# Altium project ASV4-1 Actuation Driver Board.PrjPcb (part 3 of 3)
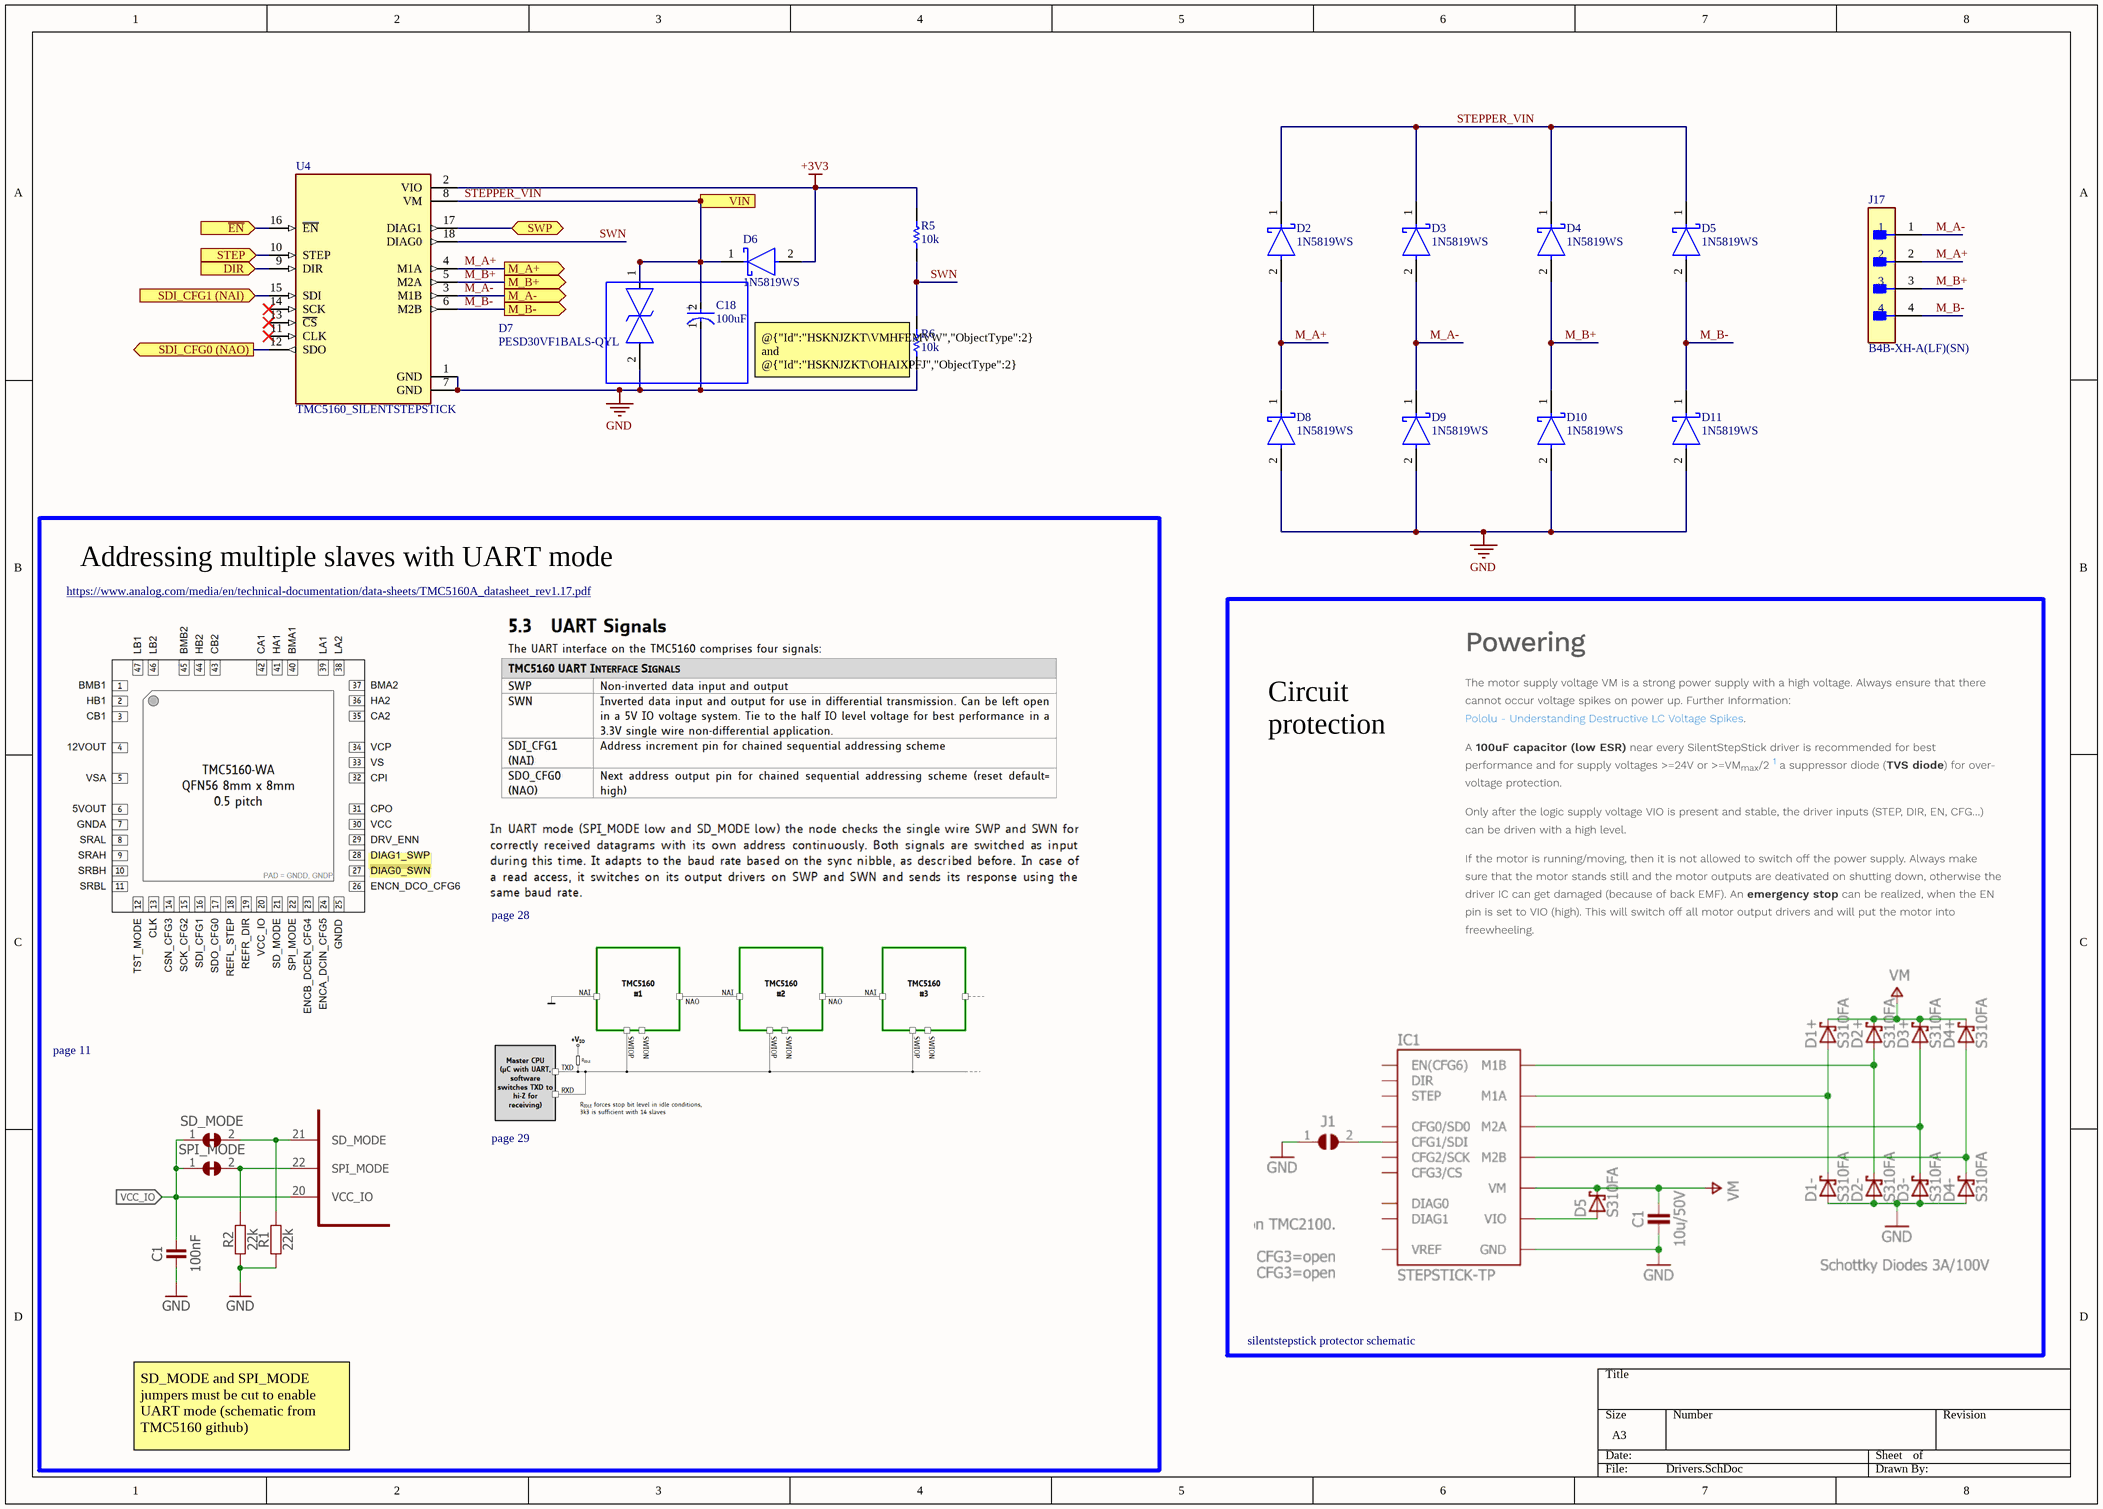
[diagram p10: Drivers.SchDoc]

## Nets that join several sheets
+3V3: Actuation (7 pins), U_Differential Encoder Receiver 1 (C25_U_Differential_Encoder_Receiver_1.1 U7_U_Differential_Encoder_Receiver_1.4 U7_U_Differential_Encoder_Receiver_1.16), U_Differential Encoder Receiver 2 (C25_U_Differential_Encoder_Receiver_2.1 U7_U_Differential_Encoder_Receiver_2.4 U7_U_Differential_Encoder_Receiver_2.16), U_Differential Encoder Receiver 3 (C25_U_Differential_Encoder_Receiver_3.1 U7_U_Differential_Encoder_Receiver_3.4 U7_U_Differential_Encoder_Receiver_3.16), Power (C20.2 D13.2 J21.2 U6.2), ISO_CAN (FB1.1 R16.1 R20.2 R21.2), STM32F407VET6 (21 pins), U_Drivers (D6_U_Drivers#1.2 R5_U_Drivers#1.2 U4_U_Drivers#1.2), U_Drivers (D6_U_Drivers#2.2 R5_U_Drivers#2.2 U4_U_Drivers#2.2), U_Drivers (D6_U_Drivers#3.2 R5_U_Drivers#3.2 U4_U_Drivers#3.2), U_Drivers (D6_U_Drivers#4.2 R5_U_Drivers#4.2 U4_U_Drivers#4.2), U_Drivers (D6_U_Drivers#5.2 R5_U_Drivers#5.2 U4_U_Drivers#5.2), U_Drivers (D6_U_Drivers#6.2 R5_U_Drivers#6.2 U4_U_Drivers#6.2), U_Drivers (D6_U_Drivers#7.2 R5_U_Drivers#7.2 U4_U_Drivers#7.2), U_Drivers (D6_U_Drivers#8.2 R5_U_Drivers#8.2 U4_U_Drivers#8.2), U_Drivers (D6_U_Drivers#9.2 R5_U_Drivers#9.2 U4_U_Drivers#9.2), U_Drivers (D6_U_Drivers#10.2 R5_U_Drivers#10.2 U4_U_Drivers#10.2), U_Drivers (D6_U_Drivers#11.2 R5_U_Drivers#11.2 U4_U_Drivers#11.2), U_Drivers (D6_U_Drivers#12.2 R5_U_Drivers#12.2 U4_U_Drivers#12.2), U_Drivers (D6_U_Drivers#13.2 R5_U_Drivers#13.2 U4_U_Drivers#13.2), U_Drivers (D6_U_Drivers#14.2 R5_U_Drivers#14.2 U4_U_Drivers#14.2), U_Differential Encoder Receiver 4 (C25_U_Differential_Encoder_Receiver_4.1 U7_U_Differential_Encoder_Receiver_4.4 U7_U_Differential_Encoder_Receiver_4.16)
+5V: Actuation (11 pins), Power (6 pins), ISO_CAN (FB2.1)
GND: Actuation (24 pins), U_Differential Encoder Receiver 1 (C25_U_Differential_Encoder_Receiver_1.2 U7_U_Differential_Encoder_Receiver_1.8 U7_U_Differential_Encoder_Receiver_1.12), U_Differential Encoder Receiver 2 (C25_U_Differential_Encoder_Receiver_2.2 U7_U_Differential_Encoder_Receiver_2.8 U7_U_Differential_Encoder_Receiver_2.12), U_Differential Encoder Receiver 3 (C25_U_Differential_Encoder_Receiver_3.2 U7_U_Differential_Encoder_Receiver_3.8 U7_U_Differential_Encoder_Receiver_3.12), Power (15 pins), ISO_CAN (6 pins), STM32F407VET6 (25 pins), U_Drivers (9 pins), U_Drivers (9 pins), U_Drivers (9 pins), U_Drivers (9 pins), U_Drivers (9 pins), U_Drivers (9 pins), U_Drivers (9 pins), U_Drivers (9 pins), U_Drivers (9 pins), U_Drivers (9 pins), U_Drivers (9 pins), U_Drivers (9 pins), U_Drivers (9 pins), U_Drivers (10 pins), U_Differential Encoder Receiver 4 (C25_U_Differential_Encoder_Receiver_4.2 U7_U_Differential_Encoder_Receiver_4.8 U7_U_Differential_Encoder_Receiver_4.12)
STEPPER_VIN: Actuation (F1.3 F1.4 J23.P), Power (C21.1 U5.7), U_Drivers (8 pins), U_Drivers (8 pins), U_Drivers (8 pins), U_Drivers (8 pins), U_Drivers (8 pins), U_Drivers (8 pins), U_Drivers (8 pins)
STEPPER_VIN: Actuation (F2.3 F2.4 J22.P), U_Drivers (8 pins), U_Drivers (8 pins), U_Drivers (8 pins), U_Drivers (8 pins), U_Drivers (8 pins), U_Drivers (8 pins), U_Drivers (8 pins)
1_N: Actuation (J3.5), U_Differential Encoder Receiver 1 (R11_U_Differential_Encoder_Receiver_1.1 U7_U_Differential_Encoder_Receiver_1.1)
1_N: Actuation (J6.5), U_Differential Encoder Receiver 2 (R11_U_Differential_Encoder_Receiver_2.1 U7_U_Differential_Encoder_Receiver_2.1)
1_N: Actuation (J9.5), U_Differential Encoder Receiver 3 (R11_U_Differential_Encoder_Receiver_3.1 U7_U_Differential_Encoder_Receiver_3.1)
1_N: Actuation (J12.5), U_Differential Encoder Receiver 4 (R11_U_Differential_Encoder_Receiver_4.1 U7_U_Differential_Encoder_Receiver_4.1)
1_P: Actuation (J3.1), U_Differential Encoder Receiver 1 (R11_U_Differential_Encoder_Receiver_1.2 U7_U_Differential_Encoder_Receiver_1.2)
1_P: Actuation (J6.1), U_Differential Encoder Receiver 2 (R11_U_Differential_Encoder_Receiver_2.2 U7_U_Differential_Encoder_Receiver_2.2)
1_P: Actuation (J9.1), U_Differential Encoder Receiver 3 (R11_U_Differential_Encoder_Receiver_3.2 U7_U_Differential_Encoder_Receiver_3.2)
1_P: Actuation (J12.1), U_Differential Encoder Receiver 4 (R11_U_Differential_Encoder_Receiver_4.2 U7_U_Differential_Encoder_Receiver_4.2)
2_N: Actuation (J3.6), U_Differential Encoder Receiver 1 (R12_U_Differential_Encoder_Receiver_1.1 U7_U_Differential_Encoder_Receiver_1.7)
2_N: Actuation (J6.6), U_Differential Encoder Receiver 2 (R12_U_Differential_Encoder_Receiver_2.1 U7_U_Differential_Encoder_Receiver_2.7)
2_N: Actuation (J9.6), U_Differential Encoder Receiver 3 (R12_U_Differential_Encoder_Receiver_3.1 U7_U_Differential_Encoder_Receiver_3.7)
2_N: Actuation (J12.6), U_Differential Encoder Receiver 4 (R12_U_Differential_Encoder_Receiver_4.1 U7_U_Differential_Encoder_Receiver_4.7)
2_P: Actuation (J3.2), U_Differential Encoder Receiver 1 (R12_U_Differential_Encoder_Receiver_1.2 U7_U_Differential_Encoder_Receiver_1.6)
2_P: Actuation (J6.2), U_Differential Encoder Receiver 2 (R12_U_Differential_Encoder_Receiver_2.2 U7_U_Differential_Encoder_Receiver_2.6)
2_P: Actuation (J9.2), U_Differential Encoder Receiver 3 (R12_U_Differential_Encoder_Receiver_3.2 U7_U_Differential_Encoder_Receiver_3.6)
2_P: Actuation (J12.2), U_Differential Encoder Receiver 4 (R12_U_Differential_Encoder_Receiver_4.2 U7_U_Differential_Encoder_Receiver_4.6)
3_N: Actuation (J3.7), U_Differential Encoder Receiver 1 (R13_U_Differential_Encoder_Receiver_1.1 U7_U_Differential_Encoder_Receiver_1.9)
3_N: Actuation (J6.7), U_Differential Encoder Receiver 2 (R13_U_Differential_Encoder_Receiver_2.1 U7_U_Differential_Encoder_Receiver_2.9)
3_N: Actuation (J9.7), U_Differential Encoder Receiver 3 (R13_U_Differential_Encoder_Receiver_3.1 U7_U_Differential_Encoder_Receiver_3.9)
3_N: Actuation (J12.7), U_Differential Encoder Receiver 4 (R13_U_Differential_Encoder_Receiver_4.1 U7_U_Differential_Encoder_Receiver_4.9)
3_P: Actuation (J3.3), U_Differential Encoder Receiver 1 (R13_U_Differential_Encoder_Receiver_1.2 U7_U_Differential_Encoder_Receiver_1.10)
3_P: Actuation (J6.3), U_Differential Encoder Receiver 2 (R13_U_Differential_Encoder_Receiver_2.2 U7_U_Differential_Encoder_Receiver_2.10)
3_P: Actuation (J9.3), U_Differential Encoder Receiver 3 (R13_U_Differential_Encoder_Receiver_3.2 U7_U_Differential_Encoder_Receiver_3.10)
3_P: Actuation (J12.3), U_Differential Encoder Receiver 4 (R13_U_Differential_Encoder_Receiver_4.2 U7_U_Differential_Encoder_Receiver_4.10)
BUZZER: Actuation (R17.2 R18.1), STM32F407VET6 (U1.35)
CAN1_RX: ISO_CAN (B1.5 LED3.1), STM32F407VET6 (U1.81)
CAN1_TX: ISO_CAN (B1.3 LED2.1), STM32F407VET6 (U1.82)
CAN_GND_ISO: Actuation (J1.3), ISO_CAN (8 pins)
CAN_N: Actuation (J1.4), ISO_CAN (B1.18 R15.1)
CAN_P: Actuation (J1.2), ISO_CAN (B1.19 JP1.1)
DIR_2: STM32F407VET6 (U1.80), U_Drivers (U4_U_Drivers#2.9)
DIR_3: STM32F407VET6 (U1.44), U_Drivers (U4_U_Drivers#6.9)
DIR_4: STM32F407VET6 (U1.46), U_Drivers (U4_U_Drivers#7.9)
DIR_5: STM32F407VET6 (U1.63), U_Drivers (U4_U_Drivers#3.9)
DIR_6: STM32F407VET6 (U1.57), U_Drivers (U4_U_Drivers#4.9)
DIR_7: STM32F407VET6 (U1.59), U_Drivers (U4_U_Drivers#5.9)
DIR_8: STM32F407VET6 (U1.39), U_Drivers (U4_U_Drivers#1.9)
DIR_9: STM32F407VET6 (U1.17), U_Drivers (U4_U_Drivers#12.9)
DIR_10: STM32F407VET6 (U1.30), U_Drivers (U4_U_Drivers#13.9)
DIR_11: STM32F407VET6 (U1.3), U_Drivers (U4_U_Drivers#14.9)
DIR_12: STM32F407VET6 (U1.8), U_Drivers (U4_U_Drivers#8.9)
DIR_13: STM32F407VET6 (U1.88), U_Drivers (U4_U_Drivers#9.9)
DIR_14: STM32F407VET6 (U1.97), U_Drivers (U4_U_Drivers#10.9)
DIR_15: STM32F407VET6 (U1.34), U_Drivers (U4_U_Drivers#11.9)
EN_2: STM32F407VET6 (U1.71), U_Drivers (U4_U_Drivers#2.16)
EN_3: STM32F407VET6 (U1.43), U_Drivers (U4_U_Drivers#6.16)
EN_4: STM32F407VET6 (U1.45), U_Drivers (U4_U_Drivers#7.16)
EN_5: STM32F407VET6 (U1.64), U_Drivers (U4_U_Drivers#3.16)
EN_6: STM32F407VET6 (U1.58), U_Drivers (U4_U_Drivers#4.16)
EN_7: STM32F407VET6 (U1.60), U_Drivers (U4_U_Drivers#5.16)
EN_8: STM32F407VET6 (U1.38), U_Drivers (U4_U_Drivers#1.16)
EN_9: STM32F407VET6 (U1.16), U_Drivers (U4_U_Drivers#12.16)
EN_10: STM32F407VET6 (U1.29), U_Drivers (U4_U_Drivers#13.16)
EN_11: STM32F407VET6 (U1.2), U_Drivers (U4_U_Drivers#14.16)
EN_12: STM32F407VET6 (U1.7), U_Drivers (U4_U_Drivers#8.16)
EN_13: STM32F407VET6 (U1.87), U_Drivers (U4_U_Drivers#9.16)
EN_14: STM32F407VET6 (U1.98), U_Drivers (U4_U_Drivers#10.16)
EN_15: STM32F407VET6 (U1.33), U_Drivers (U4_U_Drivers#11.16)
ENC1_A: U_Differential Encoder Receiver 1 (U7_U_Differential_Encoder_Receiver_1.3), STM32F407VET6 (U1.40)
ENC1_B: U_Differential Encoder Receiver 1 (U7_U_Differential_Encoder_Receiver_1.5), STM32F407VET6 (U1.42)
ENC1_Z: U_Differential Encoder Receiver 1 (U7_U_Differential_Encoder_Receiver_1.11), STM32F407VET6 (U1.41)
ENC2_A: U_Differential Encoder Receiver 2 (U7_U_Differential_Encoder_Receiver_2.3), STM32F407VET6 (U1.23)
ENC2_B: U_Differential Encoder Receiver 2 (U7_U_Differential_Encoder_Receiver_2.5), STM32F407VET6 (U1.24)
ENC2_Z: U_Differential Encoder Receiver 2 (U7_U_Differential_Encoder_Receiver_2.11), STM32F407VET6 (U1.18)
ENC3_A: U_Differential Encoder Receiver 3 (U7_U_Differential_Encoder_Receiver_3.3), STM32F407VET6 (U1.90)
ENC3_B: U_Differential Encoder Receiver 3 (U7_U_Differential_Encoder_Receiver_3.5), STM32F407VET6 (U1.91)
ENC3_Z: U_Differential Encoder Receiver 3 (U7_U_Differential_Encoder_Receiver_3.11), STM32F407VET6 (U1.83)
ENC4_A: STM32F407VET6 (U1.92), U_Differential Encoder Receiver 4 (U7_U_Differential_Encoder_Receiver_4.3)
ENC4_B: STM32F407VET6 (U1.93), U_Differential Encoder Receiver 4 (U7_U_Differential_Encoder_Receiver_4.5)
ENC4_Z: STM32F407VET6 (U1.85), U_Differential Encoder Receiver 4 (U7_U_Differential_Encoder_Receiver_4.11)
I2C3_SCL: Actuation (R19.1 U3.2), STM32F407VET6 (U1.67)
I2C3_SDA: Actuation (R22.1 U3.1), STM32F407VET6 (U1.66)
NetU4_U_Drivers#1_12: U_Drivers (U4_U_Drivers#1.12), U_Drivers (U4_U_Drivers#11.15)
NetU4_U_Drivers#1_15: U_Drivers (U4_U_Drivers#1.15), U_Drivers (U4_U_Drivers#6.12)
NetU4_U_Drivers#2_12: U_Drivers (U4_U_Drivers#2.12), U_Drivers (U4_U_Drivers#3.15)
NetU4_U_Drivers#2_15: U_Drivers (U4_U_Drivers#2.15), U_Drivers (U4_U_Drivers#10.12)
NetU4_U_Drivers#3_12: U_Drivers (U4_U_Drivers#3.12), U_Drivers (U4_U_Drivers#5.15)
NetU4_U_Drivers#4_12: U_Drivers (U4_U_Drivers#4.12), U_Drivers (U4_U_Drivers#7.15)
NetU4_U_Drivers#4_15: U_Drivers (U4_U_Drivers#4.15), U_Drivers (U4_U_Drivers#5.12)
NetU4_U_Drivers#6_15: U_Drivers (U4_U_Drivers#6.15), U_Drivers (U4_U_Drivers#7.12)
NetU4_U_Drivers#8_15: U_Drivers (U4_U_Drivers#8.15), U_Drivers (U4_U_Drivers#12.12)
NetU4_U_Drivers#9_12: U_Drivers (U4_U_Drivers#9.12), U_Drivers (U4_U_Drivers#10.15)
NetU4_U_Drivers#9_15: U_Drivers (U4_U_Drivers#9.15), U_Drivers (U4_U_Drivers#14.12)
NetU4_U_Drivers#11_12: U_Drivers (U4_U_Drivers#11.12), U_Drivers (U4_U_Drivers#13.15)
NetU4_U_Drivers#12_15: U_Drivers (U4_U_Drivers#12.15), U_Drivers (U4_U_Drivers#13.12)
PWM_1: Actuation (J14.3), STM32F407VET6 (U1.69)
PWM_2: STM32F407VET6 (U1.70), U_Drivers (U4_U_Drivers#2.10)
PWM_3: STM32F407VET6 (U1.47), U_Drivers (U4_U_Drivers#6.10)
PWM_4: STM32F407VET6 (U1.48), U_Drivers (U4_U_Drivers#7.10)
PWM_5: STM32F407VET6 (U1.65), U_Drivers (U4_U_Drivers#3.10)
PWM_6: STM32F407VET6 (U1.62), U_Drivers (U4_U_Drivers#4.10)
PWM_7: STM32F407VET6 (U1.61), U_Drivers (U4_U_Drivers#5.10)
PWM_8: STM32F407VET6 (U1.36), U_Drivers (U4_U_Drivers#1.10)
PWM_9: Actuation (J4.3), STM32F407VET6 (U1.25), U_Drivers (U4_U_Drivers#12.10)
PWM_10: Actuation (J5.3), STM32F407VET6 (U1.26), U_Drivers (U4_U_Drivers#13.10)
PWM_11: Actuation (J7.3), STM32F407VET6 (U1.4), U_Drivers (U4_U_Drivers#14.10)
PWM_12: Actuation (J8.3), STM32F407VET6 (U1.5), U_Drivers (U4_U_Drivers#8.10)
PWM_13: Actuation (J10.3), STM32F407VET6 (U1.95), U_Drivers (U4_U_Drivers#9.10)
PWM_14: Actuation (J11.3), STM32F407VET6 (U1.96), U_Drivers (U4_U_Drivers#10.10)
PWM_15: STM32F407VET6 (U1.31), U_Drivers (U4_U_Drivers#11.10)
PWM_16: Actuation (J13.3), STM32F407VET6 (U1.32)
SPI2_MISO: Actuation (J2.4 U2.B6), STM32F407VET6 (U1.53)
SPI2_MOSI: Actuation (J2.5 U2.A3), STM32F407VET6 (U1.54)
SPI2_SCK: Actuation (J2.3 U2.A4), STM32F407VET6 (U1.52)
TMC5160_UART: STM32F407VET6 (R3.2 U1.78 U1.79), U_Drivers (U4_U_Drivers#1.17), U_Drivers (U4_U_Drivers#2.17), U_Drivers (U4_U_Drivers#3.17), U_Drivers (U4_U_Drivers#4.17), U_Drivers (U4_U_Drivers#5.17), U_Drivers (U4_U_Drivers#6.17), U_Drivers (U4_U_Drivers#7.17), U_Drivers (U4_U_Drivers#8.17), U_Drivers (U4_U_Drivers#9.17), U_Drivers (U4_U_Drivers#10.17), U_Drivers (U4_U_Drivers#11.17), U_Drivers (U4_U_Drivers#12.17), U_Drivers (U4_U_Drivers#13.17), U_Drivers (U4_U_Drivers#14.17)
W5500_INT: Actuation (U2.A6), STM32F407VET6 (U1.55)
W5500_NCS: Actuation (U2.A5), STM32F407VET6 (U1.51)
W5500_RST: Actuation (U2.B5), STM32F407VET6 (U1.56)